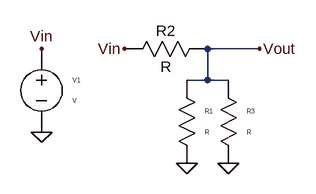
[diagram p0: schematic Draft3.asc]
Draft3.asc, the LTspice schematic file:
Version 4
SHEET 1 880 680
WIRE 352 144 272 144
WIRE 272 192 272 144
WIRE 272 192 240 192
WIRE 304 192 272 192
FLAG 352 144 Vout
FLAG 16 272 0
FLAG 16 144 Vin
FLAG 144 144 Vin
FLAG 240 320 0
FLAG 304 320 0
SYMBOL cktsym\\resistor 208 144 R90
WINDOW 3 12 0 VTop 2
WINDOW 0 -12 0 VBottom 2
SYMATTR InstName R2
SYMBOL cktsym\\vsource 16 208 R0
SYMATTR InstName V1
SYMBOL cktsym\\resistor 240 256 R0
SYMATTR InstName R1
SYMBOL cktsym\\resistor 304 256 R0
SYMATTR InstName R3

The netlist it stands for:
* Draft3.asc
R2 Vout Vin R
V1 Vin 0 V
R1 Vout 0 R
R3 Vout 0 R
.backanno
.end